# Altium schematic sheet 主控板.SchDoc
size A2
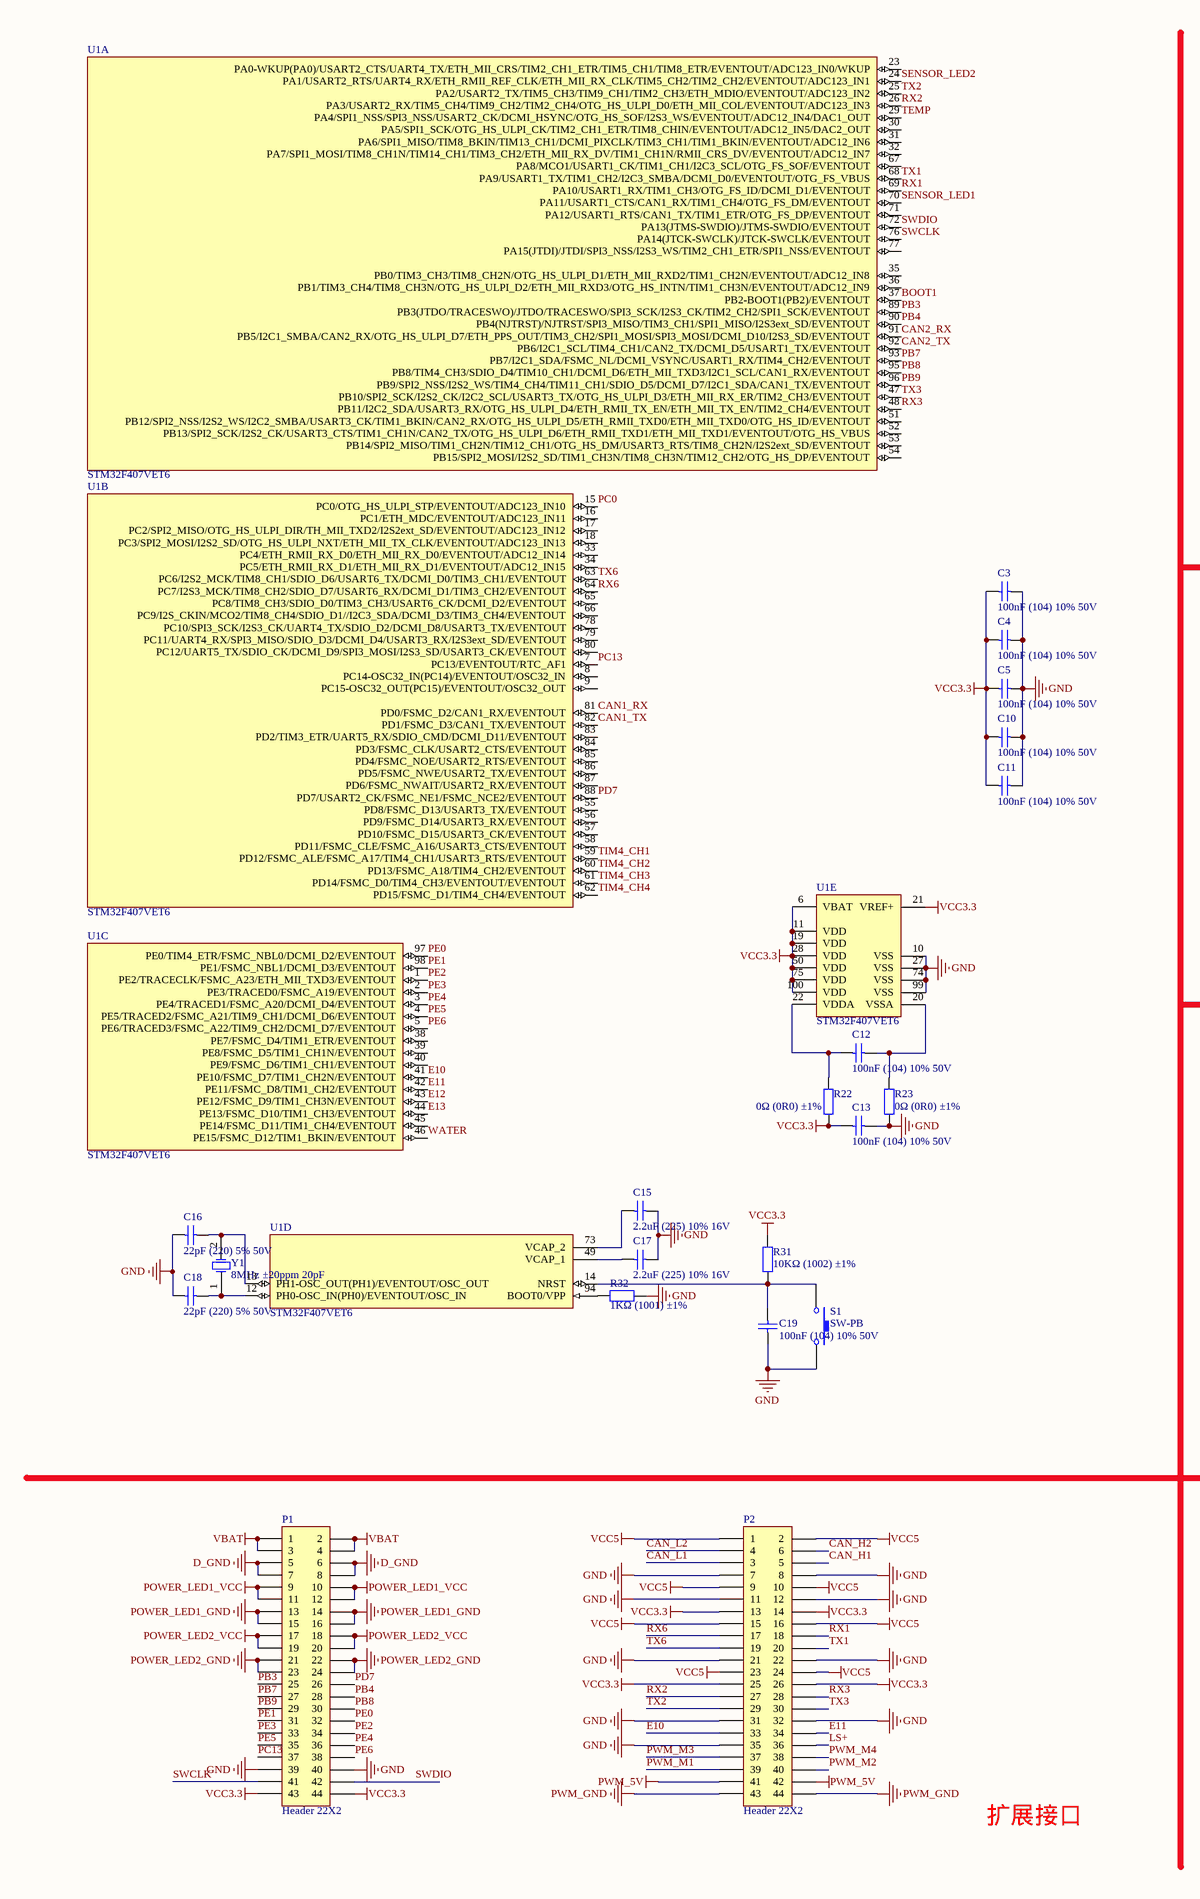
[diagram p0: 主控板.SchDoc, left]
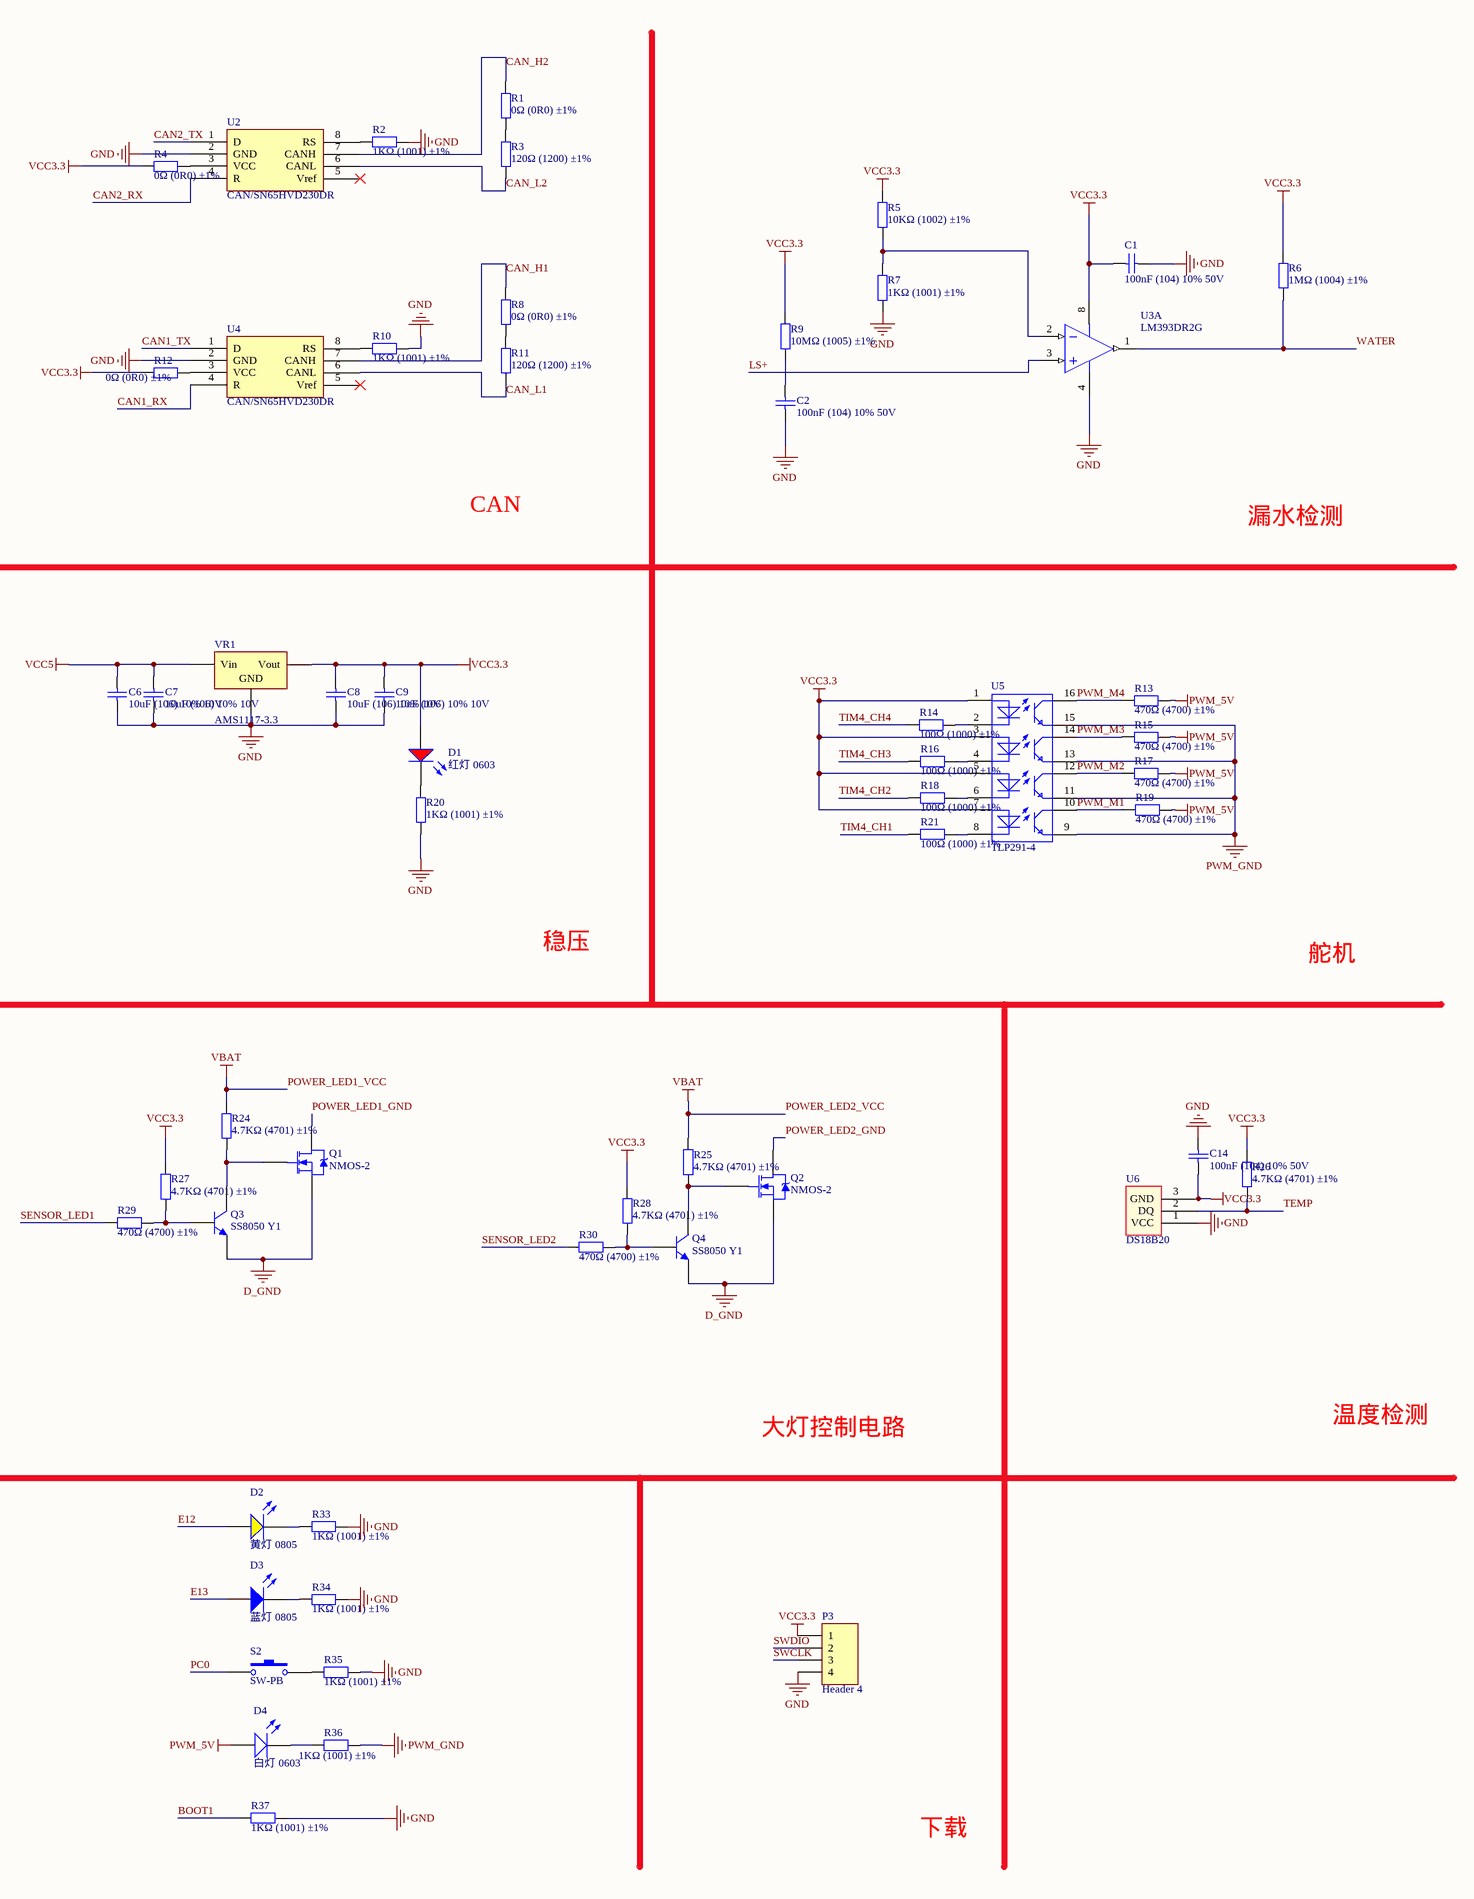
[diagram p1: 主控板.SchDoc, right]

## Parts
C1  100nF (104) 10% 50V  [0603_C]
C2  100nF (104) 10% 50V  [0603_C]
C3  100nF (104) 10% 50V  [0603_C]
C4  100nF (104) 10% 50V  [0603_C]
C5  100nF (104) 10% 50V  [0603_C]
C6  10uF (106) 10% 10V  [0603_C]
C7  10uF (106) 10% 10V  [0603_C]
C8  10uF (106) 10% 10V  [0603_C]
C9  10uF (106) 10% 10V  [0603_C]
C10  100nF (104) 10% 50V  [0603_C]
C11  100nF (104) 10% 50V  [0603_C]
C12  100nF (104) 10% 50V  [0603_C]
C13  100nF (104) 10% 50V  [0603_C]
C14  100nF (104) 10% 50V  [0603_C]
C15  2.2uF (225) 10% 16V  [0603_C]
C16  22pF (220) 5% 50V  [0603_C]
C17  2.2uF (225) 10% 16V  [0603_C]
C18  22pF (220) 5% 50V  [0603_C]
C19  100nF (104) 10% 50V  [0603_C]
D1  红灯 0603  [0603_LED_S1]
D2  黄灯 0805  [0805_LED_S1]
D3  蓝灯 0805  [0805_LED_S1]
D4  白灯 0603  [0603_LED_S1]
P1  Header 22X2  [HDR2X22]
P2  Header 22X2  [HDR2X22]
P3  Header 4  [Molex-4]
Q1  NMOS-2  [TO-252]
Q2  NMOS-2  [TO-252]
Q3  SS8050 Y1  [SOT-23(SOT-23-3)]
Q4  SS8050 Y1  [SOT-23(SOT-23-3)]
R1  0Ω (0R0) ±1%  [0603_R]
R2  1KΩ (1001) ±1%  [0603_R]
R3  120Ω (1200) ±1%  [0603_R]
R4  0Ω (0R0) ±1%  [0603_R]
R5  10KΩ (1002) ±1%  [0603_R]
R6  1MΩ (1004) ±1%  [0603_R]
R7  1KΩ (1001) ±1%  [0603_R]
R8  0Ω (0R0) ±1%  [0603_R]
R9  10MΩ (1005) ±1%  [0603_R]
R10  1KΩ (1001) ±1%  [0603_R]
R11  120Ω (1200) ±1%  [0603_R]
R12  0Ω (0R0) ±1%  [0603_R]
R13  470Ω (4700) ±1%  [0603_R]
R14  100Ω (1000) ±1%  [0603_R]
R15  470Ω (4700) ±1%  [0603_R]
R16  100Ω (1000) ±1%  [0603_R]
R17  470Ω (4700) ±1%  [0603_R]
R18  100Ω (1000) ±1%  [0603_R]
R19  470Ω (4700) ±1%  [0603_R]
R20  1KΩ (1001) ±1%  [0603_R]
R21  100Ω (1000) ±1%  [0603_R]
R22  0Ω (0R0) ±1%  [0603_R]
R23  0Ω (0R0) ±1%  [0603_R]
R24  4.7KΩ (4701) ±1%  [0603_R]
R25  4.7KΩ (4701) ±1%  [0603_R]
R26  4.7KΩ (4701) ±1%  [0603_R]
R27  4.7KΩ (4701) ±1%  [0603_R]
R28  4.7KΩ (4701) ±1%  [0603_R]
R29  470Ω (4700) ±1%  [0603_R]
R30  470Ω (4700) ±1%  [0603_R]
R31  10KΩ (1002) ±1%  [0603_R]
R32  1KΩ (1001) ±1%  [0603_R]
R33  1KΩ (1001) ±1%  [0603_R]
R34  1KΩ (1001) ±1%  [0603_R]
R35  1KΩ (1001) ±1%  [0603_R]
R36  1KΩ (1001) ±1%  [0603_R]
R37  1KΩ (1001) ±1%  [0603_R]
S1  SW-PB  [贴片按键]
S2  SW-PB  [贴片按键]
U1  STM32F407VET6  [LQFP-100_14x14x05P]  (parts A,B,C,D,E of 5)
U2  CAN/SN65HVD230DR  [SOIC-8_150mil]
U3  LM393DR2G  [SOIC-8_150mil]  (part A of 2)
U4  CAN/SN65HVD230DR  [SOIC-8_150mil]
U5  TLP291-4  [LC-SOP-16_150mil]
U6  DS18B20  [TO-92A]
VR1  AMS1117-3.3  [SOT-223]
Y1  8MHz ±20ppm 20pF  [SMD-5032_2P]

## Nets
D_GND: P1.5 P1.6 P1.7 P1.8 Q1.3(S) Q2.3(S) Q3.2(E) Q4.2(E)
GND: C1.2 C2.1 C3.1 C4.1 C5.2 C6.1 C7.1 C8.1 C9.1 C10.1 C11.1 C13.2 C14.2 C15.1 C16.1 C17.2 C18.1 C19.1 P1.39 P1.40 P2.7 P2.8 P2.11 P2.12 P2.21 P2.22 P2.31 P2.32 P2.35 P3.4 R2.2 R7.1 R10.2 R20.1 R23.1 R32.2 R33.2 R34.2 R35.2 R37.2 S1.2 U1.10(VSS) U1.27(VSS) U1.74(VSS) U1.99(VSS) U2.2(GND) U3.4(GND) U4.2(GND) U6.1(VCC) VR1.1(GND)
POWER_LED1_GND: P1.13 P1.14 P1.15 P1.16 Q1.2(D)
POWER_LED1_VCC: P1.1 P1.2 P1.3 P1.4 P1.9 P1.10 P1.11 P1.12 P1.17 P1.18 P1.19 P1.20 R24.2 R25.2  [also labelled POWER_LED2_VCC, VBAT]
POWER_LED2_GND: P1.21 P1.22 P1.23 P1.24 Q2.2(D)
PWM_5V: D4.A P2.41 P2.42 R13.2 R15.2 R17.2 R19.2
PWM_GND: P2.43 P2.44 R36.1 U5.9 U5.11 U5.13 U5.15
VCC3.3: C1.1 C3.2 C4.2 C5.1 C8.2 C9.2 C10.2 C11.2 C13.1 C14.1 D1.A P1.43 P1.44 P2.13 P2.14 P2.25 P2.26 P3.1 R4.1 R5.2 R6.2 R9.2 R12.1 R22.1 R26.2 R27.2 R28.2 R31.2 U1.6(VBAT) U1.11(VDD) U1.19(VDD) U1.21(VREF+) U1.28(VDD) U1.50(VDD) U1.75(VDD) U1.100(VDD) U3.8(V+) U5.1 U5.3 U5.5 U5.7 U6.3(GND) VR1.2(Vout)
VCC5: C6.2 C7.2 P2.1 P2.2 P2.9 P2.10 P2.15 P2.16 P2.23 P2.24 VR1.3(Vin)
BOOT1: R37.1 U1.37(PB2-BOOT1(PB2)/EVENTOUT)
CAN1_RX: U1.81(PD0/FSMC_D2/CAN1_RX/EVENTOUT) U4.4(R)
CAN1_TX: U1.82(PD1/FSMC_D3/CAN1_TX/EVENTOUT) U4.1(D)
CAN2_RX: U1.91(PB5/I2C1_SMBA/CAN2_RX/OTG_HS_ULPI_D7/ETH_PPS_OUT/TIM3_CH2/SPI1_MOSI/SPI3_MOSI/DCMI_D10/I2S3_SD/EVENTOUT) U2.4(R)
CAN2_TX: U1.92(PB6/I2C1_SCL/TIM4_CH1/CAN2_TX/DCMI_D5/USART1_TX/EVENTOUT) U2.1(D)
CAN_H1: P2.5 R8.2 U4.7(CANH)
CAN_H2: P2.6 R1.2 U2.7(CANH)
CAN_L1: P2.3 R11.1 U4.6(CANL)
CAN_L2: P2.4 R3.1 U2.6(CANL)
E10: P2.33 U1.41(PE10/FSMC_D7/TIM1_CH2N/EVENTOUT)
E11: P2.34 U1.42(PE11/FSMC_D8/TIM1_CH2/EVENTOUT)
E12: D2.A U1.43(PE12/FSMC_D9/TIM1_CH3N/EVENTOUT)
E13: D3.A U1.44(PE13/FSMC_D10/TIM1_CH3/EVENTOUT)
LS+: P2.36 U3.3(IN+)
PB3: P1.25 U1.89(PB3(JTDO/TRACESWO)/JTDO/TRACESWO/SPI3_SCK/I2S3_CK/TIM2_CH2/SPI1_SCK/EVENTOUT)
PB4: P1.28 U1.90(PB4(NJTRST)/NJTRST/SPI3_MISO/TIM3_CH1/SPI1_MISO/I2S3ext_SD/EVENTOUT)
PB7: P1.27 U1.93(PB7/I2C1_SDA/FSMC_NL/DCMI_VSYNC/USART1_RX/TIM4_CH2/EVENTOUT)
PB8: P1.30 U1.95(PB8/TIM4_CH3/SDIO_D4/TIM10_CH1/DCMI_D6/ETH_MII_TXD3/I2C1_SCL/CAN1_RX/EVENTOUT)
PB9: P1.29 U1.96(PB9/SPI2_NSS/I2S2_WS/TIM4_CH4/TIM11_CH1/SDIO_D5/DCMI_D7/I2C1_SDA/CAN1_TX/EVENTOUT)
PC0: S2.1 U1.15(PC0/OTG_HS_ULPI_STP/EVENTOUT/ADC123_IN10)
PC13: P1.37 U1.7(PC13/EVENTOUT/RTC_AF1)
PD7: P1.26 U1.88(PD7/USART2_CK/FSMC_NE1/FSMC_NCE2/EVENTOUT)
PE0: P1.32 U1.97(PE0/TIM4_ETR/FSMC_NBL0/DCMI_D2/EVENTOUT)
PE1: P1.31 U1.98(PE1/FSMC_NBL1/DCMI_D3/EVENTOUT)
PE2: P1.34 U1.1(PE2/TRACECLK/FSMC_A23/ETH_MII_TXD3/EVENTOUT)
PE3: P1.33 U1.2(PE3/TRACED0/FSMC_A19/EVENTOUT)
PE4: P1.36 U1.3(PE4/TRACED1/FSMC_A20/DCMI_D4/EVENTOUT)
PE5: P1.35 U1.4(PE5/TRACED2/FSMC_A21/TIM9_CH1/DCMI_D6/EVENTOUT)
PE6: P1.38 U1.5(PE6/TRACED3/FSMC_A22/TIM9_CH2/DCMI_D7/EVENTOUT)
PWM_M1: P2.39 R19.1 U5.10
PWM_M2: P2.40 R17.1 U5.12
PWM_M3: P2.37 R15.1 U5.14
PWM_M4: P2.38 R13.1 U5.16
RX1: P2.18 U1.69(PA10/USART1_RX/TIM1_CH3/OTG_FS_ID/DCMI_D1/EVENTOUT)
RX2: P2.27 U1.26(PA3/USART2_RX/TIM5_CH4/TIM9_CH2/TIM2_CH4/OTG_HS_ULPI_D0/ETH_MII_COL/EVENTOUT/ADC123_IN3)
RX3: P2.28 U1.48(PB11/I2C2_SDA/USART3_RX/OTG_HS_ULPI_D4/ETH_RMII_TX_EN/ETH_MII_TX_EN/TIM2_CH4/EVENTOUT)
RX6: P2.17 U1.64(PC7/I2S3_MCK/TIM8_CH2/SDIO_D7/USART6_RX/DCMI_D1/TIM3_CH2/EVENTOUT)
SENSOR_LED1: R29.1 U1.70(PA11/USART1_CTS/CAN1_RX/TIM1_CH4/OTG_FS_DM/EVENTOUT)
SENSOR_LED2: R30.1 U1.24(PA1/USART2_RTS/UART4_RX/ETH_RMII_REF_CLK/ETH_MII_RX_CLK/TIM5_CH2/TIM2_CH2/EVENTOUT/ADC123_IN1)
SWCLK: P1.41 P3.3 U1.76(PA14(JTCK-SWCLK)/JTCK-SWCLK/EVENTOUT)
SWDIO: P1.42 P3.2 U1.72(PA13(JTMS-SWDIO)/JTMS-SWDIO/EVENTOUT)
TEMP: R26.1 U1.29(PA4/SPI1_NSS/SPI3_NSS/USART2_CK/DCMI_HSYNC/OTG_HS_SOF/I2S3_WS/EVENTOUT/ADC12_IN4/DAC1_OUT) U6.2(DQ)
TIM4_CH1: R21.1 U1.59(PD12/FSMC_ALE/FSMC_A17/TIM4_CH1/USART3_RTS/EVENTOUT)
TIM4_CH2: R18.1 U1.60(PD13/FSMC_A18/TIM4_CH2/EVENTOUT)
TIM4_CH3: R16.1 U1.61(PD14/FSMC_D0/TIM4_CH3/EVENTOUT/EVENTOUT)
TIM4_CH4: R14.1 U1.62(PD15/FSMC_D1/TIM4_CH4/EVENTOUT)
TX1: P2.20 U1.68(PA9/USART1_TX/TIM1_CH2/I2C3_SMBA/DCMI_D0/EVENTOUT/OTG_FS_VBUS)
TX2: P2.29 U1.25(PA2/USART2_TX/TIM5_CH3/TIM9_CH1/TIM2_CH3/ETH_MDIO/EVENTOUT/ADC123_IN2)
TX3: P2.30 U1.47(PB10/SPI2_SCK/I2S2_CK/I2C2_SCL/USART3_TX/OTG_HS_ULPI_D3/ETH_MII_RX_ER/TIM2_CH3/EVENTOUT)
TX6: P2.19 U1.63(PC6/I2S2_MCK/TIM8_CH1/SDIO_D6/USART6_TX/DCMI_D0/TIM3_CH1/EVENTOUT)
WATER: R6.1 U1.46(PE15/FSMC_D12/TIM1_BKIN/EVENTOUT) U3.1(OUT)
NetC2_2: C2.2 R9.1
NetC12_1: C12.1 R22.2 U1.22(VDDA)
NetC12_2: C12.2 R23.2 U1.20(VSSA)
NetC15_2: C15.2 U1.73(VCAP_2)
NetC16_2: C16.2 U1.13(PH1-OSC_OUT(PH1)/EVENTOUT/OSC_OUT) Y1.2(OSC2)
NetC17_1: C17.1 U1.49(VCAP_1)
NetC18_2: C18.2 U1.12(PH0-OSC_IN(PH0)/EVENTOUT/OSC_IN) Y1.1(OSC1)
NetC19_2: C19.2 R31.1 S1.1 U1.14(NRST)
NetD1_K: D1.K R20.2
NetD2_K: D2.K R33.1
NetD3_K: D3.K R34.1
NetD4_K: D4.K R36.2
NetQ1_1: Q1.1(G) Q3.3(C) R24.1
NetQ2_1: Q2.1(G) Q4.3(C) R25.1
NetQ3_1: Q3.1(B) R27.1 R29.2
NetQ4_1: Q4.1(B) R28.1 R30.2
NetR1_1: R1.1 R3.2
NetR2_1: R2.1 U2.8(RS)
NetR4_2: R4.2 U2.3(VCC)
NetR5_1: R5.1 R7.2 U3.2(IN-)
NetR8_1: R8.1 R11.2
NetR10_1: R10.1 U4.8(RS)
NetR12_2: R12.2 U4.3(VCC)
NetR14_2: R14.2 U5.2
NetR16_2: R16.2 U5.4
NetR18_2: R18.2 U5.6
NetR21_2: R21.2 U5.8
NetR32_1: R32.1 U1.94(BOOT0/VPP)
NetR35_1: R35.1 S2.2

Not connected (* = marked no-connect by the designer): U1 8(PC14-OSC32_IN(PC14)/EVENTOUT/OSC32_IN) 9(PC15-OSC32_OUT(PC15)/EVENTOUT/OSC32_OUT) 16(PC1/ETH_MDC/EVENTOUT/ADC123_IN11) 17(PC2/SPI2_MISO/OTG_HS_ULPI_DIR/TH_MII_TXD2/I2S2ext_SD/EVENTOUT/ADC123_IN12) 18(PC3/SPI2_MOSI/I2S2_SD/OTG_HS_ULPI_NXT/ETH_MII_TX_CLK/EVENTOUT/ADC123_IN13) 23(PA0-WKUP(PA0)/USART2_CTS/UART4_TX/ETH_MII_CRS/TIM2_CH1_ETR/TIM5_CH1/TIM8_ETR/EVENTOUT/ADC123_IN0/WKUP) 30(PA5/SPI1_SCK/OTG_HS_ULPI_CK/TIM2_CH1_ETR/TIM8_CHIN/EVENTOUT/ADC12_IN5/DAC2_OUT) 31(PA6/SPI1_MISO/TIM8_BKIN/TIM13_CH1/DCMI_PIXCLK/TIM3_CH1/TIM1_BKIN/EVENTOUT/ADC12_IN6) 32(PA7/SPI1_MOSI/TIM8_CH1N/TIM14_CH1/TIM3_CH2/ETH_MII_RX_DV/TIM1_CH1N/RMII_CRS_DV/EVENTOUT/ADC12_IN7) 33(PC4/ETH_RMII_RX_D0/ETH_MII_RX_D0/EVENTOUT/ADC12_IN14) 34(PC5/ETH_RMII_RX_D1/ETH_MII_RX_D1/EVENTOUT/ADC12_IN15) 35(PB0/TIM3_CH3/TIM8_CH2N/OTG_HS_ULPI_D1/ETH_MII_RXD2/TIM1_CH2N/EVENTOUT/ADC12_IN8) 36(PB1/TIM3_CH4/TIM8_CH3N/OTG_HS_ULPI_D2/ETH_MII_RXD3/OTG_HS_INTN/TIM1_CH3N/EVENTOUT/ADC12_IN9) 38(PE7/FSMC_D4/TIM1_ETR/EVENTOUT) 39(PE8/FSMC_D5/TIM1_CH1N/EVENTOUT) 40(PE9/FSMC_D6/TIM1_CH1/EVENTOUT) 45(PE14/FSMC_D11/TIM1_CH4/EVENTOUT) 51(PB12/SPI2_NSS/I2S2_WS/I2C2_SMBA/USART3_CK/TIM1_BKIN/CAN2_RX/OTG_HS_ULPI_D5/ETH_RMII_TXD0/ETH_MII_TXD0/OTG_HS_ID/EVENTOUT) 52(PB13/SPI2_SCK/I2S2_CK/USART3_CTS/TIM1_CH1N/CAN2_TX/OTG_HS_ULPI_D6/ETH_RMII_TXD1/ETH_MII_TXD1/EVENTOUT/OTG_HS_VBUS) 53(PB14/SPI2_MISO/TIM1_CH2N/TIM12_CH1/OTG_HS_DM/USART3_RTS/TIM8_CH2N/I2S2ext_SD/EVENTOUT) 54(PB15/SPI2_MOSI/I2S2_SD/TIM1_CH3N/TIM8_CH3N/TIM12_CH2/OTG_HS_DP/EVENTOUT) 55(PD8/FSMC_D13/USART3_TX/EVENTOUT) 56(PD9/FSMC_D14/USART3_RX/EVENTOUT) 57(PD10/FSMC_D15/USART3_CK/EVENTOUT) 58(PD11/FSMC_CLE/FSMC_A16/USART3_CTS/EVENTOUT) 65(PC8/TIM8_CH3/SDIO_D0/TIM3_CH3/USART6_CK/DCMI_D2/EVENTOUT) 66(PC9/I2S_CKIN/MCO2/TIM8_CH4/SDIO_D1//I2C3_SDA/DCMI_D3/TIM3_CH4/EVENTOUT) 67(PA8/MCO1/USART1_CK/TIM1_CH1/I2C3_SCL/OTG_FS_SOF/EVENTOUT) 71(PA12/USART1_RTS/CAN1_TX/TIM1_ETR/OTG_FS_DP/EVENTOUT) 77(PA15(JTDI)/JTDI/SPI3_NSS/I2S3_WS/TIM2_CH1_ETR/SPI1_NSS/EVENTOUT) 78(PC10/SPI3_SCK/I2S3_CK/UART4_TX/SDIO_D2/DCMI_D8/USART3_TX/EVENTOUT) 79(PC11/UART4_RX/SPI3_MISO/SDIO_D3/DCMI_D4/USART3_RX/I2S3ext_SD/EVENTOUT) 80(PC12/UART5_TX/SDIO_CK/DCMI_D9/SPI3_MOSI/I2S3_SD/USART3_CK/EVENTOUT) 83(PD2/TIM3_ETR/UART5_RX/SDIO_CMD/DCMI_D11/EVENTOUT) 84(PD3/FSMC_CLK/USART2_CTS/EVENTOUT) 85(PD4/FSMC_NOE/USART2_RTS/EVENTOUT) 86(PD5/FSMC_NWE/USART2_TX/EVENTOUT) 87(PD6/FSMC_NWAIT/USART2_RX/EVENTOUT); U2 5(Vref)*; U4 5(Vref)*

## Notes on the sheet
- CAN
- 漏水检测
- 稳压
- 舵机
- 大灯控制电路
- 温度检测
- 扩展接口
- 下载

## Library data of the parts
C1-C5 C10-C14 C19 = 0603 100nF (104) 10% 50V: 贴片电容; ComponentLink1Description: 供应商链接; ComponentLink1URL: http://www.szlcsc.com/product/details_15331.html; Package: 0603; Supplier: LC; SuppliersPartNumber: C14663
C6-C9 = 0603 10uF (106) 10% 10V: 贴片电容; ComponentLink1Description: 供应商链接; ComponentLink1URL: http://www.szlcsc.com/product/details_20411.html; Package: 0603; Supplier: LC; SuppliersPartNumber: C19702
C15 C17 = 0603 2.2uF (225) 10% 16V: 贴片电容; ComponentLink1Description: 供应商链接; ComponentLink1URL: http://www.szlcsc.com/product/details_24366.html; Package: 0603; Supplier: LC; SuppliersPartNumber: C23630
C16 C18 = 0603 22pF (220) 5% 50V: 贴片电容; ComponentLink1Description: 供应商链接; ComponentLink1URL: http://www.szlcsc.com/product/details_2005.html; Package: 0603; Supplier: LC; SuppliersPartNumber: C1653
D1 = 0603 红灯: 发光二极管; ComponentLink1Description: 供应商链接; ComponentLink1URL: http://www.szlcsc.com/product/details_2659.html; Package: 0603; Supplier: LC; SuppliersPartNumber: C2286
D2 = 0805 黄灯: 发光二极管; ComponentLink1Description: 供应商链接; ComponentLink1URL: http://www.szlcsc.com/product/details_2669.html; Package: 0805; Supplier: LC; SuppliersPartNumber: C2296
D3 = 0805 蓝灯: 发光二极管; ComponentLink1Description: 供应商链接; ComponentLink1URL: http://www.szlcsc.com/product/details_2666.html; Package: 0805; Supplier: LC; SuppliersPartNumber: C2293
D4 = 0603 白灯: 发光二极管; ComponentLink1Description: 供应商链接; ComponentLink1URL: http://www.szlcsc.com/product/details_2663.html; Package: 0603; Supplier: LC; SuppliersPartNumber: C2290
P1 P2 = Header 22X2: Header, 22-Pin, Dual row; LatestRevisionDate: 17-Jul-2002; LatestRevisionNote: Re-released for DXP Platform.; Publisher: Altium Limited
P3 = Header 4_1: Header, 4-Pin; LatestRevisionDate: 17-Jul-2002; LatestRevisionNote: Re-released for DXP Platform.; Publisher: Altium Limited
Q1 Q2 = NMOS-2: N-Channel Power MOSFET; Note: Pin 2 is electrically connected to pin 4.; Published: 8-Jun-2000; LatestRevisionDate: 17-Jul-2002; LatestRevisionNote: Re-released for DXP Platform.; DatasheetVersion: PD-9.814; PackageVersion: Feb-1997; PackageReference: TO-220AB; Publisher: Altium Limited; PackageDescription: TO, Thru-Hole, Vertical, Heatsink Mounted; 3 In-Line Leads; Pitch 2.54 mm; ComponentLink1Description: Manufacturer Link; ComponentLink1URL: http://www.irf.com/
Q3 Q4 = SOT-23 SS8050 Y1: 三极管; ComponentLink1Description: 供应商链接; ComponentLink1URL: http://www.szlcsc.com/product/details_2507.html; Package: SOT-23; Supplier: LC; SuppliersPartNumber: C2150
R1 R4 R8 R12 R22 R23 = 0603 0Ω (0R0) 1%: 贴片电阻; ComponentLink1Description: 供应商链接; ComponentLink1URL: http://www.szlcsc.com/product/details_21903.html; Package: 0603; Supplier: LC; SuppliersPartNumber: C21189
R2 R7 R10 R20 R32-R37 = 0603 1KΩ (1001) 1%: 贴片电阻; ComponentLink1Description: 供应商链接; ComponentLink1URL: http://www.szlcsc.com/product/details_21904.html; Package: 0603; Supplier: LC; SuppliersPartNumber: C21190
R3 R11 = 0603 120Ω (1200) 1%: 贴片电阻; ComponentLink1Description: 供应商链接; ComponentLink1URL: http://www.szlcsc.com/product/details_23514.html; Package: 0603; Supplier: LC; SuppliersPartNumber: C22787
R5 R31 = 0603 10KΩ (1002) 1%: 贴片电阻; ComponentLink1Description: 供应商链接; ComponentLink1URL: http://www.szlcsc.com/product/details_26547.html; Package: 0603; Supplier: LC; SuppliersPartNumber: C25804
R6 = 0603 1MΩ (1004) 1%: 贴片电阻; ComponentLink1Description: 供应商链接; ComponentLink1URL: http://www.szlcsc.com/product/details_23662.html; Package: 0603; Supplier: LC; SuppliersPartNumber: C22935
R9 = 0603 10MΩ (1005) 1%: 贴片电阻; ComponentLink1Description: 供应商链接; ComponentLink1URL: http://www.szlcsc.com/product/details_7726.html; Package: 0603; Supplier: LC; SuppliersPartNumber: C7250
R13 R15 R17 R19 R29 R30 = 0603 470Ω (4700) 1%: 贴片电阻; ComponentLink1Description: 供应商链接; ComponentLink1URL: http://www.szlcsc.com/product/details_23906.html; Package: 0603; Supplier: LC; SuppliersPartNumber: C23179
R14 R16 R18 R21 = 0603 100Ω (1000) 1%: 贴片电阻; ComponentLink1Description: 供应商链接; ComponentLink1URL: http://www.szlcsc.com/product/details_23502.html; Package: 0603; Supplier: LC; SuppliersPartNumber: C22775
R24-R28 = 0603 4.7KΩ (4701) 1%: 贴片电阻; ComponentLink1Description: 供应商链接; ComponentLink1URL: http://www.szlcsc.com/product/details_23889.html; Package: 0603; Supplier: LC; SuppliersPartNumber: C23162
S1 S2 = SW-PB: Switch; Published: 24-Mar-1999; LatestRevisionDate: 17-Jul-2002; LatestRevisionNote: Re-released for DXP Platform.; PackageReference: SPST-2; Publisher: Altium Limited; PackageDescription: Switch; 2 Leads
U1 = STM32F407VET6: ARM; ComponentLink1Description: 供应商链接; ComponentLink1URL: http://www.szlcsc.com/product/details_29482.html; Package: LQFP-100_14x14x05P; Supplier: LC; SuppliersPartNumber: C28730
U2 U4 = CAN/SN65HVD230DR_[C12084]: CAN; ComponentLink1Description: 供应商链接; ComponentLink1URL: http://www.szlcsc.com/product/details_12661.html; Package: SOIC-8_150mil; Supplier: LC; SuppliersPartNumber: C12084
U3 = LM393DR2G_[C7955]: 电压比较器; ComponentLink1Description: 供应商链接; ComponentLink1URL: http://www.szlcsc.com/product/details_8432.html; Package: SOIC-8; Supplier: LC; SuppliersPartNumber: C7955
U5 = TLP521-4
VR1 = SOT-223 AMS1117-3.3: 低压差线性稳压(LDO); ComponentLink1Description: 供应商链接; ComponentLink1URL: http://www.szlcsc.com/product/details_6652.html; Package: SOT-223; Supplier: LC; SuppliersPartNumber: C6186
Y1 = SMD-5032_2P 8MHz 20ppm 20pF: 贴片晶振; ComponentLink1Description: 供应商链接; ComponentLink1URL: http://www.szlcsc.com/product/details_117214.html; Package: SMD-5032_2P; Supplier: LC; SuppliersPartNumber: C115962